# Altium project BTS_Arm_Controller.PrjPcb
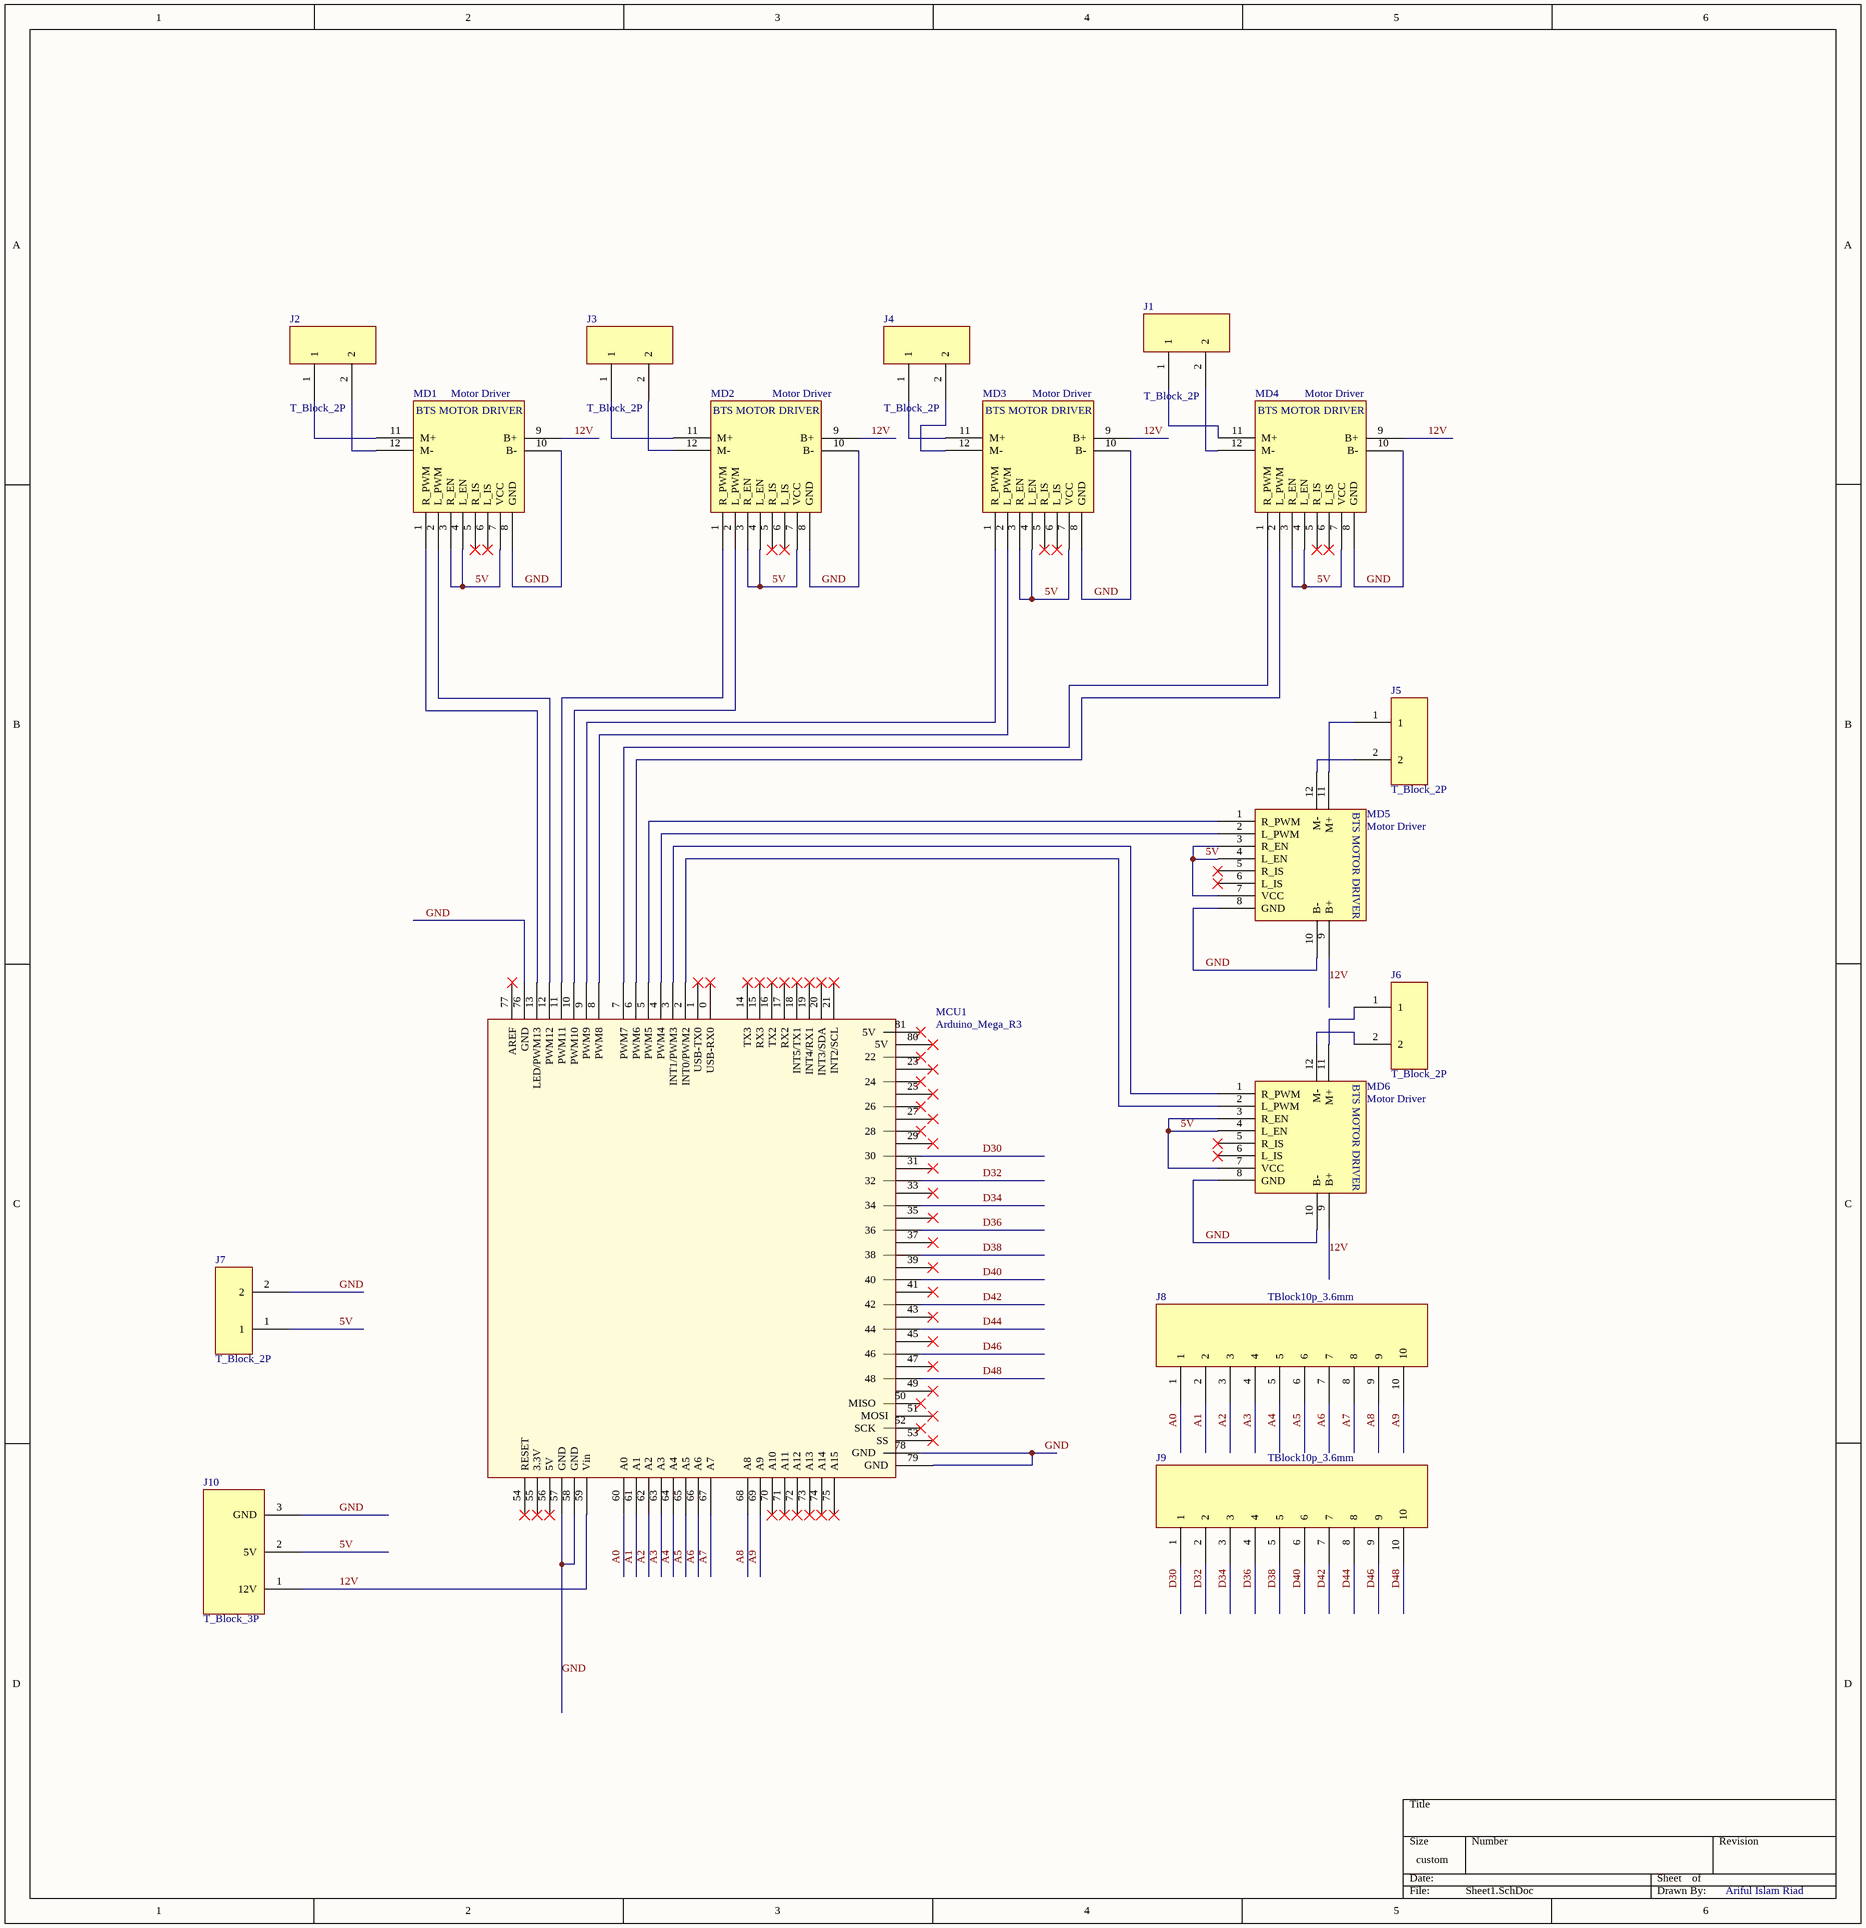
[diagram p0: Sheet1.SchDoc]
1 sheet, 17 parts. Net scope: global (net labels, ports and power ports of the same name join across sheets).
Board file: PCB1.PcbDoc

## Sheet Sheet1.SchDoc
size 381 x 393 mm; SheetNumber: 1; SheetTotal: 1

### Parts
J1  T_Block_2P  [T_Block_2P]
J2  T_Block_2P  [T_Block_2P]
J3  T_Block_2P  [T_Block_2P]
J4  T_Block_2P  [T_Block_2P]
J5  T_Block_2P  [T_Block_2P]
J6  T_Block_2P  [T_Block_2P]
J7  T_Block_2P  [T_Block_2P]
J8  TBlock10p_3.6mm  [T_block_3.6mm]
J9  TBlock10p_3.6mm  [T_block_3.6mm]
J10  T_Block_3P  [T_Block_3P]
MCU1  Arduino_Mega_R3  [PCB_footprint_mega]
MD1  Motor Driver  [PCB_BTS]
MD2  Motor Driver  [PCB_BTS]
MD3  Motor Driver  [PCB_BTS]
MD4  Motor Driver  [PCB_BTS]
MD5  Motor Driver  [PCB_BTS]
MD6  Motor Driver  [PCB_BTS]

### Nets
5V: J7.1 J10.2(5V) MD1.3(R_EN) MD1.4(L_EN) MD1.7(VCC) MD2.3(R_EN) MD2.4(L_EN) MD2.7(VCC) MD3.3(R_EN) MD3.4(L_EN) MD3.7(VCC) MD4.3(R_EN) MD4.4(L_EN) MD4.7(VCC) MD5.3(R_EN) MD5.4(L_EN) MD5.7(VCC) MD6.3(R_EN) MD6.4(L_EN) MD6.7(VCC)
12V: J10.1(12V) MCU1.59(Vin) MD1.9(B+) MD2.9(B+) MD3.9(B+) MD4.9(B+) MD5.9(B+) MD6.9(B+)
A0: J8.1 MCU1.60(A0)
A1: J8.2 MCU1.61(A1)
A2: J8.3 MCU1.62(A2)
A3: J8.4 MCU1.63(A3)
A4: J8.5 MCU1.64(A4)
A5: J8.6 MCU1.65(A5)
A6: J8.7 MCU1.66(A6)
A7: J8.8 MCU1.67(A7)
A8: J8.9 MCU1.68(A8)
A9: J8.10 MCU1.69(A9)
D30: J9.1 MCU1.30
D32: J9.2 MCU1.32
D34: J9.3 MCU1.34
D36: J9.4 MCU1.36
D38: J9.5 MCU1.38
D40: J9.6 MCU1.40
D42: J9.7 MCU1.42
D44: J9.8 MCU1.44
D46: J9.9 MCU1.46
D48: J9.10 MCU1.48
GND: J7.2 J10.3(GND) MCU1.57(GND) MCU1.58(GND) MCU1.76(GND) MCU1.78(GND) MCU1.79(GND) MD1.8(GND) MD1.10(B-) MD2.8(GND) MD2.10(B-) MD3.8(GND) MD3.10(B-) MD4.8(GND) MD4.10(B-) MD5.8(GND) MD5.10(B-) MD6.8(GND) MD6.10(B-)
NetJ1_1: J1.1 MD4.11(M+)
NetJ1_2: J1.2 MD4.12(M-)
NetJ2_1: J2.1 MD1.11(M+)
NetJ2_2: J2.2 MD1.12(M-)
NetJ3_1: J3.1 MD2.11(M+)
NetJ3_2: J3.2 MD2.12(M-)
NetJ4_1: J4.1 MD3.11(M+)
NetJ4_2: J4.2 MD3.12(M-)
NetJ5_1: J5.1 MD5.11(M+)
NetJ5_2: J5.2 MD5.12(M-)
NetJ6_1: J6.1 MD6.11(M+)
NetJ6_2: J6.2 MD6.12(M-)
NetMCU1_2: MCU1.2(INT0/PWM2) MD6.2(L_PWM)
NetMCU1_3: MCU1.3(INT1/PWM3) MD6.1(R_PWM)
NetMCU1_4: MCU1.4(PWM4) MD5.2(L_PWM)
NetMCU1_5: MCU1.5(PWM5) MD5.1(R_PWM)
NetMCU1_6: MCU1.6(PWM6) MD4.2(L_PWM)
NetMCU1_7: MCU1.7(PWM7) MD4.1(R_PWM)
NetMCU1_8: MCU1.8(PWM8) MD3.2(L_PWM)
NetMCU1_9: MCU1.9(PWM9) MD3.1(R_PWM)
NetMCU1_10: MCU1.10(PWM10) MD2.2(L_PWM)
NetMCU1_11: MCU1.11(PWM11) MD2.1(R_PWM)
NetMCU1_12: MCU1.12(PWM12) MD1.2(L_PWM)
NetMCU1_13: MCU1.13(LED/PWM13) MD1.1(R_PWM)

Not connected (* = marked no-connect by the designer): MCU1 0(USB-RX0)* 1(USB-TX0)* 14(TX3)* 15(RX3)* 16(TX2)* 17(RX2)* 18(INT5/TX1)* 19(INT4/RX1)* 20(INT3/SDA)* 21(INT2/SCL)* 22* 23* 24* 25* 26* 27* 28* 29* 31* 33* 35* 37* 39* 41* 43* 45* 47* 49* 50(MISO)* 51(MOSI)* 52(SCK)* 53(SS)* 54(RESET)* 55(3.3V)* 56(5V)* 70(A10)* 71(A11)* 72(A12)* 73(A13)* 74(A14)* 75(A15)* 77(AREF)* 80(5V)* 81(5V)*; MD1 5(R_IS)* 6(L_IS)*; MD2 5(R_IS)* 6(L_IS)*; MD3 5(R_IS)* 6(L_IS)*; MD4 5(R_IS)* 6(L_IS)*; MD5 5(R_IS)* 6(L_IS)*; MD6 5(R_IS)* 6(L_IS)*

### Notes on the sheet
- Ariful Islam Riad
- (in symbol BTS) BTS MOTOR DRIVER

### Library data of the parts
J1-J7 = T_Block_2P: Terminal
J8 J9 = TBlock10p_3.6mm: Terminal
J10 = T_Block_3P: Terminal
MCU1 = Mega: Arduino Mega
MD1-MD6 = BTS